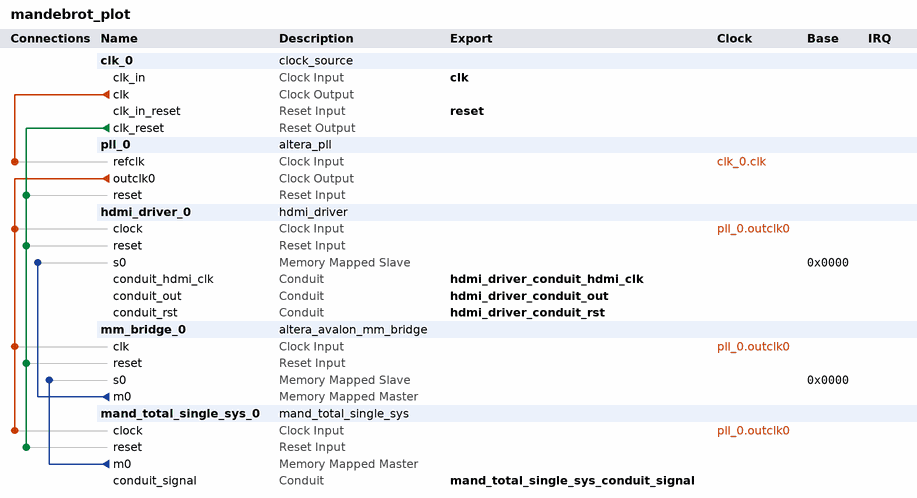
[diagram p0: system contents]
# Platform Designer (Qsys) system mandebrot_plot, Cyclone V 5CSEBA6U23I7
# Parameters at their usual value, and those the tool derives, are not listed.
package require -exact qsys 23.1
create_system mandebrot_plot
set_project_property DEVICE_FAMILY {Cyclone V}
set_project_property DEVICE 5CSEBA6U23I7

add_instance clk_0 clock_source 23.1
set_instance_parameter_value clk_0 clockFrequency 50000000

add_instance pll_0 altera_pll 23.1
set_instance_parameter_value pll_0 gui_device_speed_grade 1
set_instance_parameter_value pll_0 gui_number_of_clocks 1
set_instance_parameter_value pll_0 gui_operation_mode direct
set_instance_parameter_value pll_0 gui_output_clock_frequency0 100.0
set_instance_parameter_value pll_0 gui_pll_mode {Integer-N PLL}
set_instance_parameter_value pll_0 gui_reference_clock_frequency 50.0
set_instance_parameter_value pll_0 gui_use_locked false

add_instance hdmi_driver_0 hdmi_driver 1.0
set_instance_parameter_value hdmi_driver_0 WIDTH 8

add_instance mm_bridge_0 altera_avalon_mm_bridge 23.1
set_instance_parameter_value mm_bridge_0 ADDRESS_UNITS SYMBOLS
set_instance_parameter_value mm_bridge_0 ADDRESS_WIDTH 10
set_instance_parameter_value mm_bridge_0 DATA_WIDTH 32
set_instance_parameter_value mm_bridge_0 MAX_PENDING_RESPONSES 4
set_instance_parameter_value mm_bridge_0 USE_AUTO_ADDRESS_WIDTH 0

add_instance mand_total_single_sys_0 mand_total_single_sys 1.0
set_instance_parameter_value mand_total_single_sys_0 WIDTH 32

# connections
add_connection clk_0.clk pll_0.refclk clock
add_connection pll_0.outclk0 hdmi_driver_0.clock clock
add_connection pll_0.outclk0 mand_total_single_sys_0.clock clock
add_connection pll_0.outclk0 mm_bridge_0.clk clock
add_connection clk_0.clk_reset hdmi_driver_0.reset reset
add_connection clk_0.clk_reset mand_total_single_sys_0.reset reset
add_connection clk_0.clk_reset mm_bridge_0.reset reset
add_connection clk_0.clk_reset pll_0.reset reset
add_connection mand_total_single_sys_0.m0 mm_bridge_0.s0 avalon
set_connection_parameter_value mand_total_single_sys_0.m0/mm_bridge_0.s0 baseAddress 0x0000
add_connection mm_bridge_0.m0 hdmi_driver_0.s0 avalon
set_connection_parameter_value mm_bridge_0.m0/hdmi_driver_0.s0 baseAddress 0x0000

# exported interfaces
add_interface clk clock sink
set_interface_property clk EXPORT_OF clk_0.clk_in
add_interface hdmi_driver_conduit_hdmi_clk conduit end
set_interface_property hdmi_driver_conduit_hdmi_clk EXPORT_OF hdmi_driver_0.conduit_hdmi_clk
add_interface hdmi_driver_conduit_out conduit end
set_interface_property hdmi_driver_conduit_out EXPORT_OF hdmi_driver_0.conduit_out
add_interface hdmi_driver_conduit_rst conduit end
set_interface_property hdmi_driver_conduit_rst EXPORT_OF hdmi_driver_0.conduit_rst
add_interface mand_total_single_sys_conduit_signal conduit end
set_interface_property mand_total_single_sys_conduit_signal EXPORT_OF mand_total_single_sys_0.conduit_signal
add_interface reset reset sink
set_interface_property reset EXPORT_OF clk_0.clk_in_reset

set_interconnect_requirement {$system} qsys_mm.clockCrossingAdapter HANDSHAKE
set_interconnect_requirement {$system} qsys_mm.enableEccProtection FALSE
set_interconnect_requirement {$system} qsys_mm.insertDefaultSlave FALSE
set_interconnect_requirement {$system} qsys_mm.maxAdditionalLatency 1

save_system mandebrot_plot.qsys
